# EAGLE design MiP_Proto-Back (EAGLE 6.5.0)
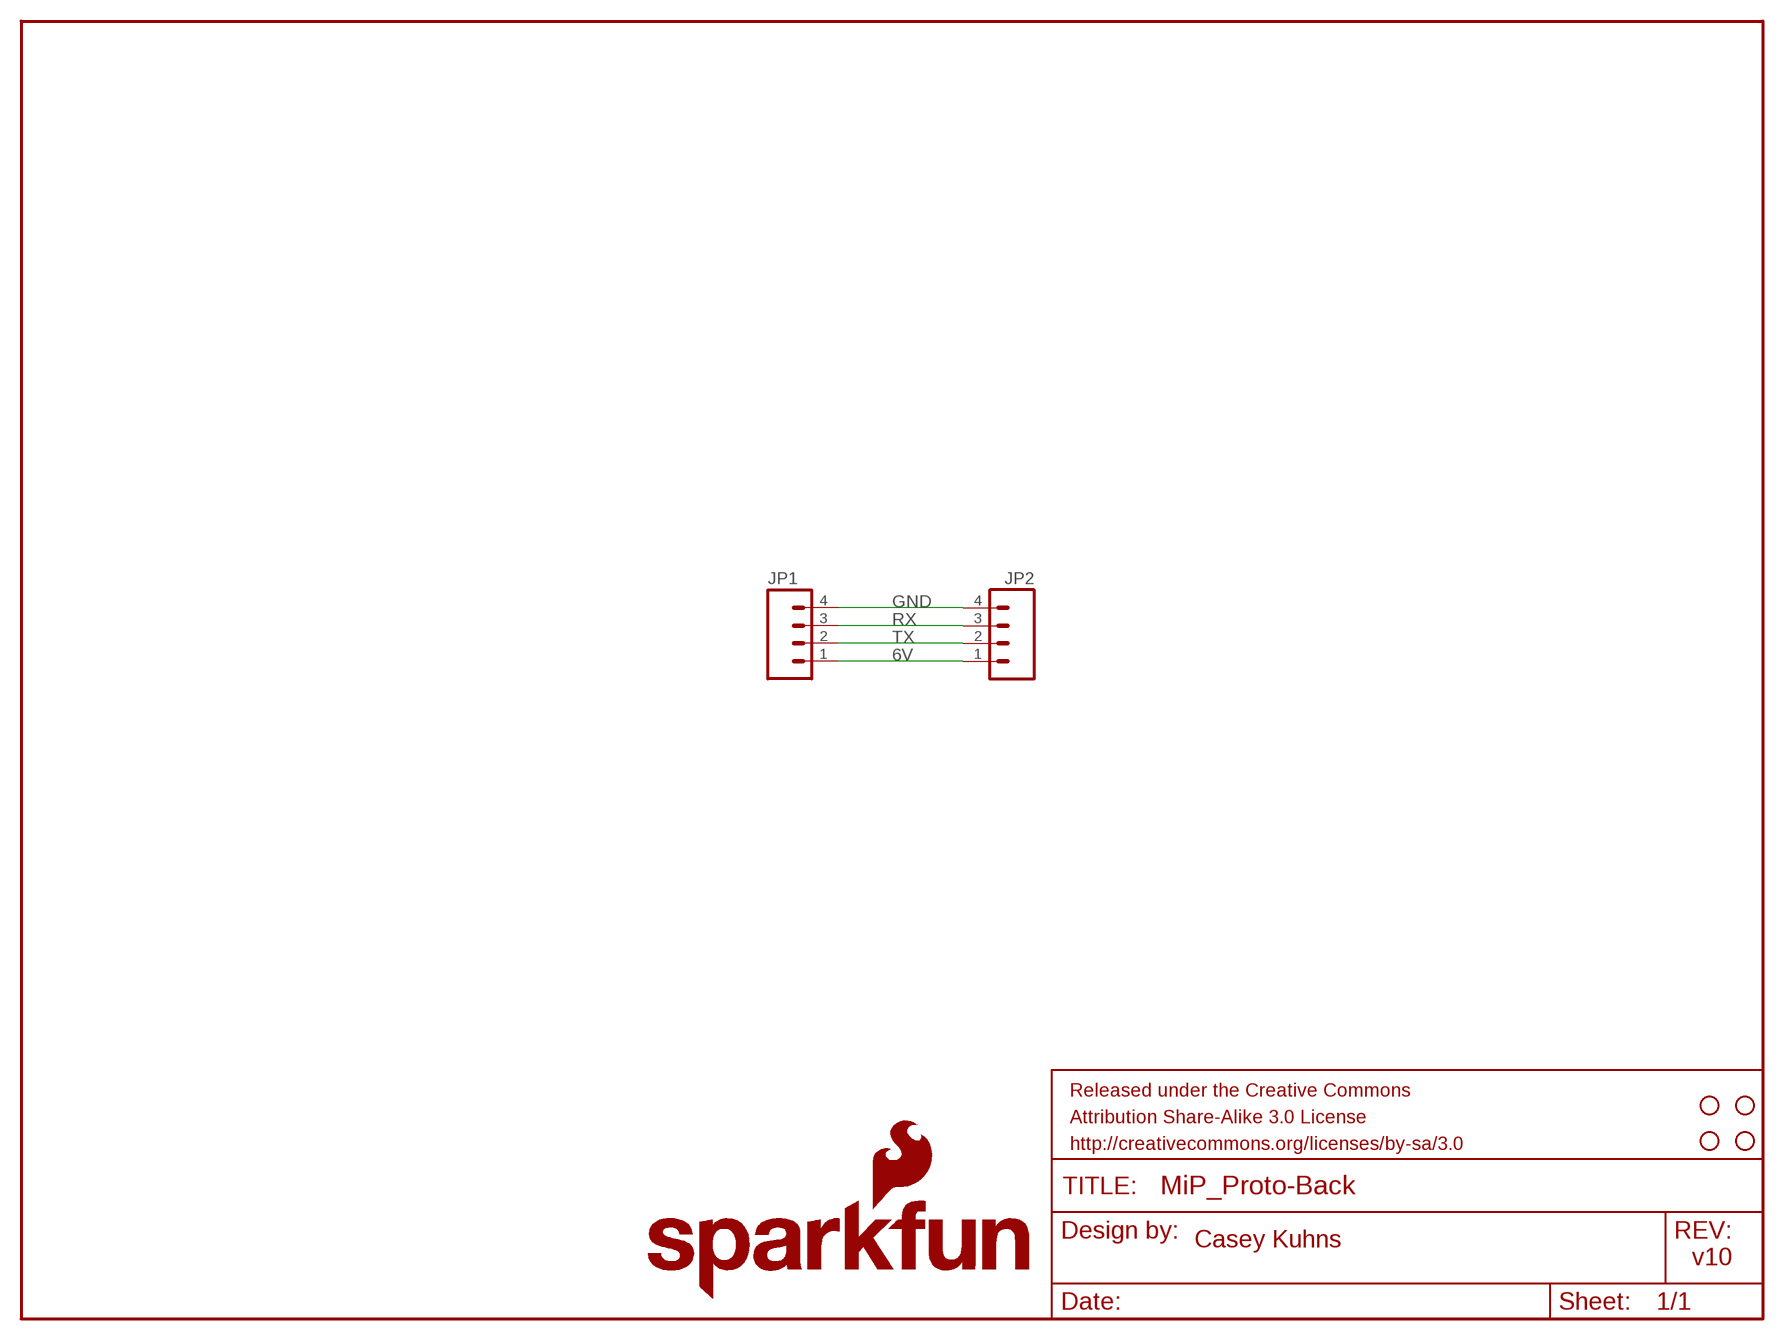
[diagram p0: schematic, sheet 1]

## Parts
FRAME1  FRAME-LETTER  [CREATIVE_COMMONS]
JP1  M04JST  [1X04-1.5MM_JST]
JP2  M04PTH  [1X04]
LOGO1  SFE_LOGO_NAME_FLAME.2_INCH  [SFE_LOGO_NAME_FLAME_.2]
STANDOFF1  STAND-OFF  [STAND-OFF]
STANDOFF2  STAND-OFF  [STAND-OFF]
STANDOFF3  STAND-OFF  [STAND-OFF]
STANDOFF4  STAND-OFF  [STAND-OFF]

## Nets
6V: JP1.1 JP2.1
GND: JP1.4 JP2.4
RX: JP1.3 JP2.3
TX: JP1.2 JP2.2

## Notes on the sheet
- Casey Kuhns
- v10

## Library data of the parts
FRAME1 = SparkFun-Aesthetics:FRAME-LETTER: Schematic Frame Standard 8.5x11 US Letter frame
JP1 JP2 = SparkFun-Connectors:M04: Header 4 Standard 4-pin 0.1" header. Use with straight break away headers (SKU : PRT-00116), right angle break away headers (PRT-00553), swiss pins (PRT-00743), machine pins (PRT-00117), and female headers (PRT-00115). Molex polarized connector foot print use with SKU : PRT-08231 with associated crimp pins and housings. 1MM SMD Version SKU: PRT-10208
LOGO1 = SparkFun-Aesthetics:SFE_LOGO_NAME_FLAME: SFE Logo, name and flame This is the SparkFun full logo. The logo on the schematic will always be the same size; the package variant is the height of the flame part of the logo. Default layer for the logo on the board is tSilk.
STANDOFF1-STANDOFF4 = SparkFun-Electromechanical:STAND-OFF: #4 Stand Off This is the mechanical footprint for a #4 phillips button head screw. Use the keepout ring to avoid running the screw head into surrounding components. SKU : PRT-00447

## Board
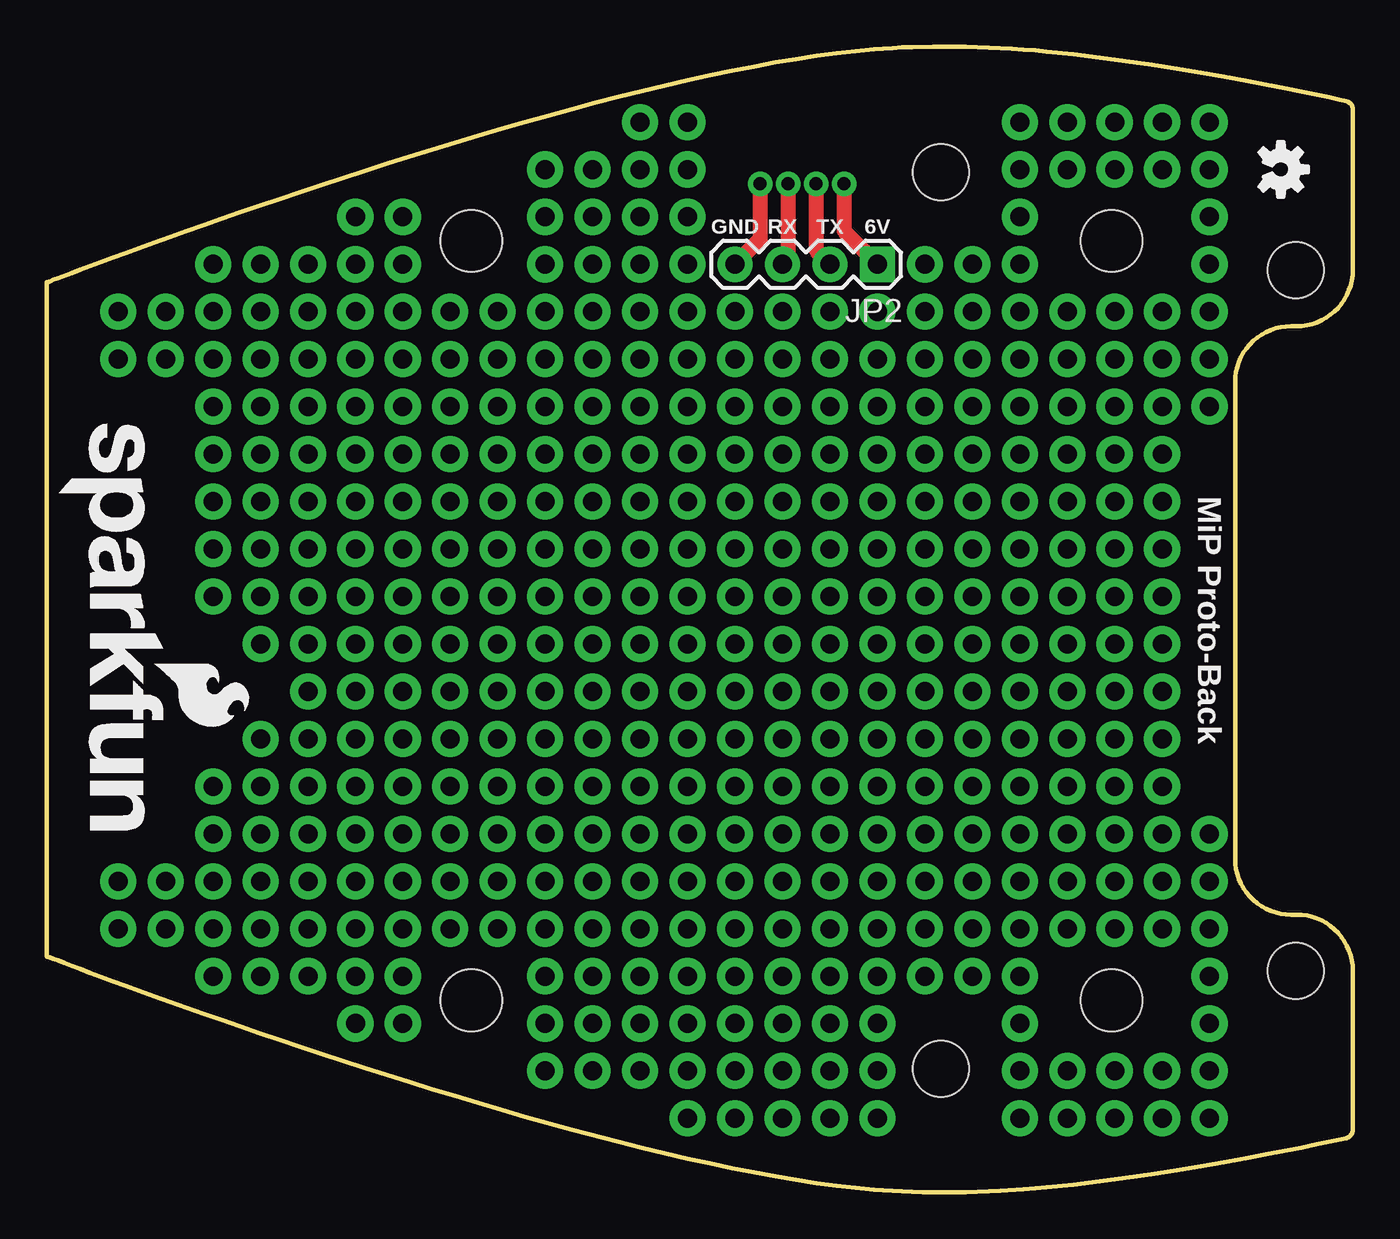
[diagram p1: board, top side]
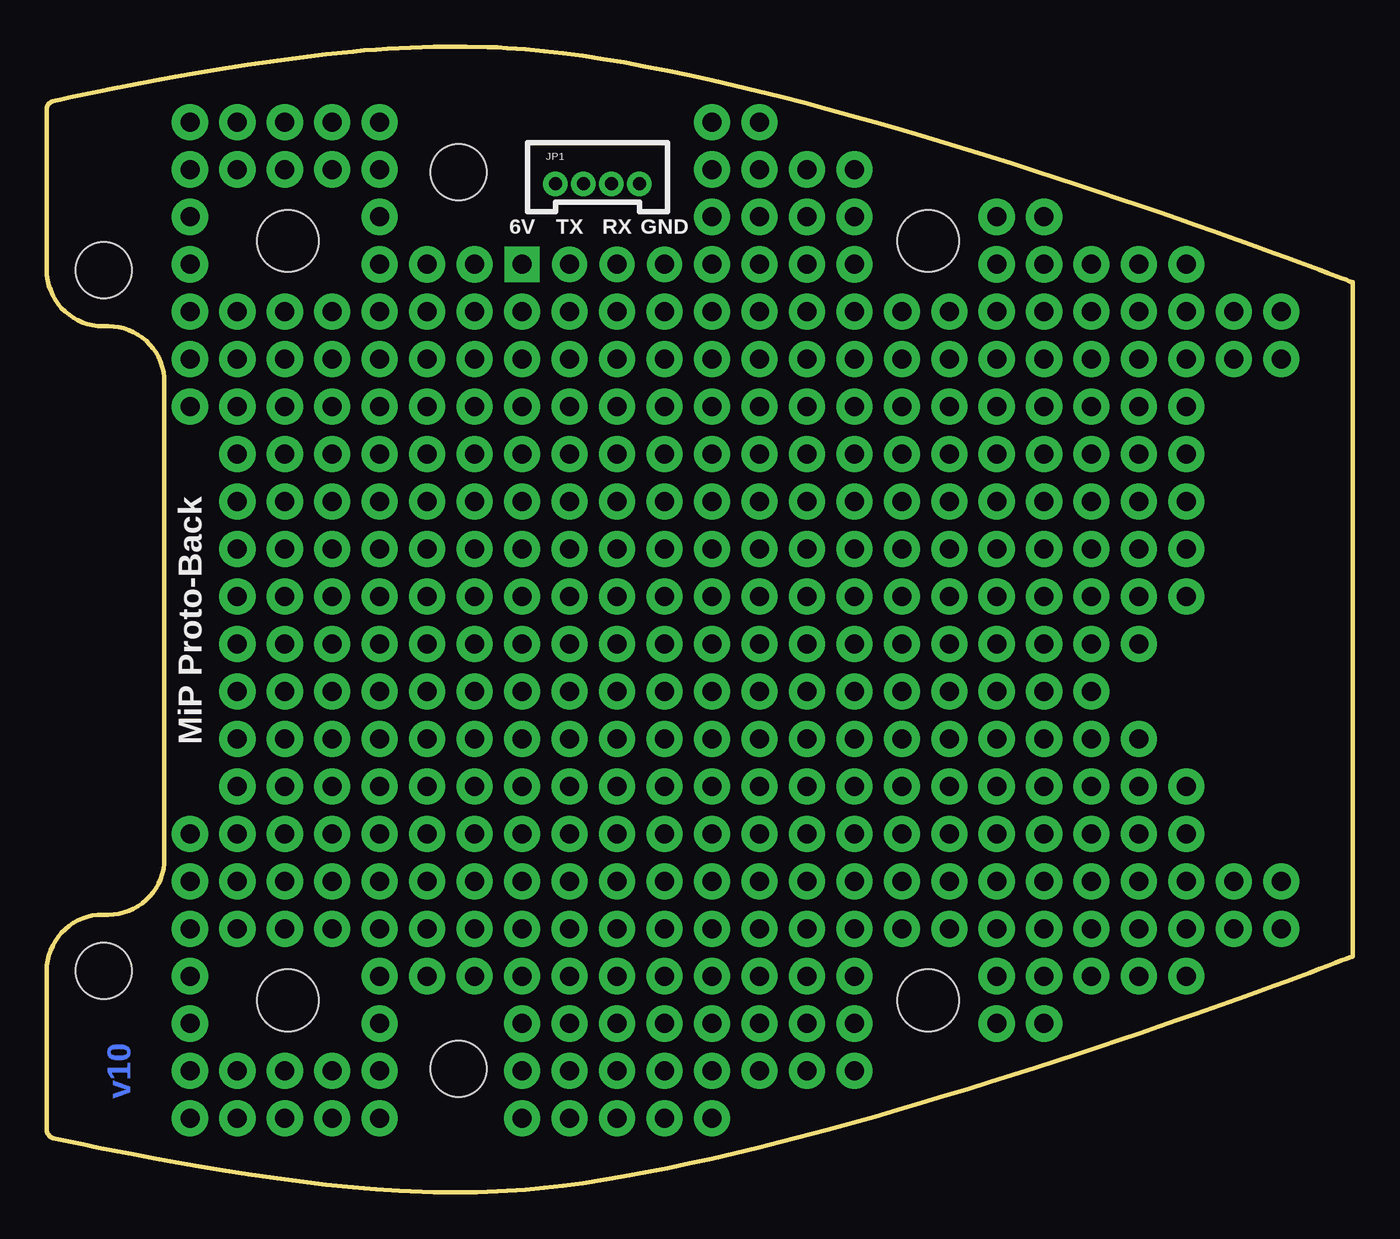
[diagram p2: board, bottom side, seen from below]

Size 69.91 x 61.32 mm. Coordinates in mm from the lower left corner, seen from the top.
Outline: 69.56,2.9 arc76 69.91,3.35 69.91,11.86 arc90 66.91,14.86 66.61,14.86 arc-90 63.61,17.86 63.61,43.36 arc-90 66.61,46.36 66.91,46.36 arc90 69.91,49.36 69.91,57.98 arc77 69.58,58.4 69.18,58.49 68.64,58.61 67.97,58.75 67.18,58.92 66.28,59.1 65.28,59.29 64.19,59.5 63.02,59.71 61.78,59.93 60.49,60.14 59.15,60.35 57.77,60.55 56.37,60.74 54.95,60.91 53.52,61.06 52.91,61.12 52.29,61.17 51.67,61.21 50.43,61.27 49.21,61.31 48.61,61.32 47.43,61.32 46.31,61.3 45.78,61.28 45.26,61.25 44.76,61.22 44.29,61.19 43.3,61.09 42.27,60.98 41.21,60.83 40.11,60.66 39,60.48 37.85,60.26 36.69,60.03 35.5,59.79 34.3,59.52 33.08,59.24 31.85,58.94 30.61,58.63 29.36,58.31 28.11,57.97 26.85,57.63 25.59,57.28 24.34,56.92 23.09,56.55 21.85,56.18 20.62,55.8 19.4,55.43 18.19,55.05 17,54.67 15.83,54.29 14.68,53.91 13.56,53.54 12.46,53.17 11.4,52.81 10.36,52.46 9.36,52.11 8.4,51.77 7.47,51.45 6.59,51.13 5.75,50.83 4.96,50.55 4.22,50.28 3.53,50.03 2.89,49.79 2.31,49.58 1.79,49.38 1.33,49.21 0.61,48.94 0.34,48.84 0.21,48.78 arc-10 0,48.71 0,12.67 arc63 0.04,12.61 0.16,12.57 0.35,12.49 0.61,12.4 0.94,12.27 1.33,12.12 1.79,11.95 2.31,11.75 2.89,11.54 3.53,11.3 4.22,11.05 4.96,10.78 5.75,10.5 6.59,10.2 7.48,9.88 8.4,9.56 9.36,9.22 10.36,8.87 11.4,8.52 12.46,8.16 13.56,7.79 14.68,7.42 15.83,7.04 17,6.66 18.19,6.28 19.4,5.9 20.62,5.52 21.85,5.15 23.09,4.78 24.34,4.41 25.59,4.05 28.11,3.35 30.61,2.69 31.85,2.38 33.08,2.09 34.3,1.8 35.5,1.54 36.69,1.29 37.85,1.06 39,0.85 40.11,0.66 41.21,0.49 42.27,0.35 43.3,0.23 44.29,0.14 44.76,0.1 45.26,0.07 45.78,0.05 46.31,0.03 46.87,0.01 47.43,0 48.61,0 49.21,0.01 50.43,0.05 51.05,0.08 52.29,0.16 52.91,0.21 53.52,0.26 54.95,0.41 56.37,0.59 57.77,0.77 59.14,0.97 60.48,1.18 61.78,1.39 63.01,1.6 64.18,1.81 65.26,2.02 66.26,2.21 67.16,2.39 67.95,2.56 68.62,2.7 69.16,2.82 69.56,2.9
Copper layers (1*16): Top 0.035mm / dielectric 1.5mm / Bottom 0.035mm
Design rules "default": minimum track width 7mil, minimum drill 15mil, track to track 8mil, track to pad 8mil, pad to pad 8mil, via to via 8mil, smd to smd 8mil, copper to edge 8mil, drill to drill 8mil, minimum pad ring 12mil, minimum via ring 10mil, stop-mask expansion 4mil, vias tented up to drill 20mil, thermal gap 10mil
Holes 3 mm at 47.86,6.61 47.86,54.61 66.86,49.36 66.86,11.86

### Footprints (pad centres in the part's own frame; a part is rotated, then mirrored left to right if it is on the bottom)
1X04-1.5MM_JST = drill 0.7: 1 0,0; 2 1.5,0; 3 3,0; 4 4.5,0
1X04 = drill 1.016 pad 1.88 square: 1 0,0 | drill 1.016 pad 1.88: 2 2.54,0; 3 5.08,0; 4 7.62,0
STAND-OFF = hole 3.302: 0,0

### Placement (x,y rotation side)
FRAME1  13.98,-8.75 0 top  (outside the outline)
JP1  42.68,53.99 0 bottom
JP2  44.46,49.67 180 top
LOGO1  0.55,41.86 270 top
LOGO2  OSHW-LOGOS  [OSHW-LOGO-S]  66.05,54.75 270 top
STANDOFF1  22.72,10.27 0 top
STANDOFF2  22.72,50.91 0 top
STANDOFF3  57.01,50.91 0 top
STANDOFF4  57.01,10.27 0 top

### Tracks (layer width: path | path; a pad name or v marks a point on that pad's centre or on a via)
6V
  Top 0.813: JP1.1 42.68,51.45 JP2.1
GND
  Top 0.813: JP1.4 38.18,51.01 JP2.4
N$1  (via drill 1.02 pad 1.93)
  other vias: 11.44,29.35
N$2  (via drill 1.02 pad 1.93)
  other vias: 13.98,29.35
N$3  (via drill 1.02 pad 1.93)
  other vias: 13.98,26.81
N$4  (via drill 1.02 pad 1.93)
  other vias: 13.98,24.27
N$5  (via drill 1.02 pad 1.93)
  other vias: 11.44,24.27
N$6  (via drill 1.02 pad 1.93)
  other vias: 13.98,21.73
N$7  (via drill 1.02 pad 1.93)
  other vias: 8.9,21.73
N$8  (via drill 1.02 pad 1.93)
  other vias: 16.52,29.35
N$9  (via drill 1.02 pad 1.93)
  other vias: 16.52,26.81
N$10  (via drill 1.02 pad 1.93)
  other vias: 16.52,24.27
N$11  (via drill 1.02 pad 1.93)
  other vias: 16.52,21.73
N$12  (via drill 1.02 pad 1.93)
  other vias: 19.06,29.35
N$13  (via drill 1.02 pad 1.93)
  other vias: 19.06,26.81
N$14  (via drill 1.02 pad 1.93)
  other vias: 19.06,24.27
N$15  (via drill 1.02 pad 1.93)
  other vias: 19.06,21.73
N$16  (via drill 1.02 pad 1.93)
  other vias: 21.6,29.35
N$17  (via drill 1.02 pad 1.93)
  other vias: 21.6,26.81
N$18  (via drill 1.02 pad 1.93)
  other vias: 21.6,24.27
N$19  (via drill 1.02 pad 1.93)
  other vias: 21.6,21.73
N$20  (via drill 1.02 pad 1.93)
  other vias: 24.14,29.35
N$21  (via drill 1.02 pad 1.93)
  other vias: 24.14,26.81
N$22  (via drill 1.02 pad 1.93)
  other vias: 24.14,24.27
N$23  (via drill 1.02 pad 1.93)
  other vias: 24.14,21.73
N$24  (via drill 1.02 pad 1.93)
  other vias: 26.68,29.35
N$25  (via drill 1.02 pad 1.93)
  other vias: 26.68,26.81
N$26  (via drill 1.02 pad 1.93)
  other vias: 26.68,24.27
N$27  (via drill 1.02 pad 1.93)
  other vias: 26.68,21.73
N$28  (via drill 1.02 pad 1.93)
  other vias: 29.22,29.35
N$29  (via drill 1.02 pad 1.93)
  other vias: 29.22,26.81
N$30  (via drill 1.02 pad 1.93)
  other vias: 29.22,24.27
N$31  (via drill 1.02 pad 1.93)
  other vias: 29.22,21.73
N$32  (via drill 1.02 pad 1.93)
  other vias: 31.76,29.35
N$33  (via drill 1.02 pad 1.93)
  other vias: 31.76,26.81
N$34  (via drill 1.02 pad 1.93)
  other vias: 31.76,24.27
N$35  (via drill 1.02 pad 1.93)
  other vias: 31.76,21.73
N$36  (via drill 1.02 pad 1.93)
  other vias: 34.3,29.35
N$37  (via drill 1.02 pad 1.93)
  other vias: 34.3,26.81
N$38  (via drill 1.02 pad 1.93)
  other vias: 34.3,24.27
N$39  (via drill 1.02 pad 1.93)
  other vias: 34.3,21.73
N$40  (via drill 1.02 pad 1.93)
  other vias: 36.84,29.35
N$41  (via drill 1.02 pad 1.93)
  other vias: 36.84,26.81
N$42  (via drill 1.02 pad 1.93)
  other vias: 36.84,24.27
N$43  (via drill 1.02 pad 1.93)
  other vias: 36.84,21.73
N$44  (via drill 1.02 pad 1.93)
  other vias: 39.38,29.35
N$45  (via drill 1.02 pad 1.93)
  other vias: 39.38,26.81
N$46  (via drill 1.02 pad 1.93)
  other vias: 39.38,24.27
N$47  (via drill 1.02 pad 1.93)
  other vias: 39.38,21.73
N$48  (via drill 1.02 pad 1.93)
  other vias: 41.92,29.35
N$49  (via drill 1.02 pad 1.93)
  other vias: 41.92,26.81
N$50  (via drill 1.02 pad 1.93)
  other vias: 41.92,24.27
N$51  (via drill 1.02 pad 1.93)
  other vias: 41.92,21.73
N$52  (via drill 1.02 pad 1.93)
  other vias: 44.46,29.35
N$53  (via drill 1.02 pad 1.93)
  other vias: 44.46,26.81
N$54  (via drill 1.02 pad 1.93)
  other vias: 44.46,24.27
N$55  (via drill 1.02 pad 1.93)
  other vias: 44.46,21.73
N$56  (via drill 1.02 pad 1.93)
  other vias: 47,29.35
N$57  (via drill 1.02 pad 1.93)
  other vias: 47,26.81
N$58  (via drill 1.02 pad 1.93)
  other vias: 47,24.27
N$59  (via drill 1.02 pad 1.93)
  other vias: 47,21.73
N$60  (via drill 1.02 pad 1.93)
  other vias: 49.54,29.35
N$61  (via drill 1.02 pad 1.93)
  other vias: 49.54,26.81
N$62  (via drill 1.02 pad 1.93)
  other vias: 49.54,24.27
N$63  (via drill 1.02 pad 1.93)
  other vias: 49.54,21.73
N$64  (via drill 1.02 pad 1.93)
  other vias: 52.08,29.35
N$65  (via drill 1.02 pad 1.93)
  other vias: 52.08,26.81
N$66  (via drill 1.02 pad 1.93)
  other vias: 52.08,24.27
N$67  (via drill 1.02 pad 1.93)
  other vias: 52.08,21.73
N$68  (via drill 1.02 pad 1.93)
  other vias: 13.98,19.19
N$69  (via drill 1.02 pad 1.93)
  other vias: 13.98,16.65
N$70  (via drill 1.02 pad 1.93)
  other vias: 13.98,14.11
N$71  (via drill 1.02 pad 1.93)
  other vias: 13.98,11.57
N$72  (via drill 1.02 pad 1.93)
  other vias: 16.52,19.19
N$73  (via drill 1.02 pad 1.93)
  other vias: 16.52,16.65
N$74  (via drill 1.02 pad 1.93)
  other vias: 16.52,14.11
N$75  (via drill 1.02 pad 1.93)
  other vias: 16.52,11.57
N$76  (via drill 1.02 pad 1.93)
  other vias: 19.06,19.19
N$77  (via drill 1.02 pad 1.93)
  other vias: 19.06,16.65
N$78  (via drill 1.02 pad 1.93)
  other vias: 19.06,14.11
N$79  (via drill 1.02 pad 1.93)
  other vias: 19.06,11.57
N$80  (via drill 1.02 pad 1.93)
  other vias: 21.6,19.19
N$81  (via drill 1.02 pad 1.93)
  other vias: 21.6,16.65
N$82  (via drill 1.02 pad 1.93)
  other vias: 21.6,14.11
N$83  (via drill 1.02 pad 1.93)
  other vias: 19.06,9.03
N$84  (via drill 1.02 pad 1.93)
  other vias: 24.14,19.19
N$85  (via drill 1.02 pad 1.93)
  other vias: 24.14,16.65
N$86  (via drill 1.02 pad 1.93)
  other vias: 24.14,14.11
N$88  (via drill 1.02 pad 1.93)
  other vias: 26.68,19.19
N$89  (via drill 1.02 pad 1.93)
  other vias: 26.68,16.65
N$90  (via drill 1.02 pad 1.93)
  other vias: 26.68,14.11
N$91  (via drill 1.02 pad 1.93)
  other vias: 26.68,11.57
N$92  (via drill 1.02 pad 1.93)
  other vias: 29.22,19.19
N$93  (via drill 1.02 pad 1.93)
  other vias: 29.22,16.65
N$94  (via drill 1.02 pad 1.93)
  other vias: 29.22,14.11
N$95  (via drill 1.02 pad 1.93)
  other vias: 29.22,11.57
N$96  (via drill 1.02 pad 1.93)
  other vias: 31.76,19.19
N$97  (via drill 1.02 pad 1.93)
  other vias: 31.76,16.65
N$98  (via drill 1.02 pad 1.93)
  other vias: 31.76,14.11
N$99  (via drill 1.02 pad 1.93)
  other vias: 31.76,11.57
N$117  (via drill 1.02 pad 1.93)
  other vias: 3.82,16.65
N$118  (via drill 1.02 pad 1.93)
  other vias: 3.82,14.11
N$121  (via drill 1.02 pad 1.93)
  other vias: 6.36,16.65
N$122  (via drill 1.02 pad 1.93)
  other vias: 6.36,14.11
N$124  (via drill 1.02 pad 1.93)
  other vias: 8.9,19.19
N$125  (via drill 1.02 pad 1.93)
  other vias: 8.9,16.65
N$126  (via drill 1.02 pad 1.93)
  other vias: 8.9,14.11
N$127  (via drill 1.02 pad 1.93)
  other vias: 8.9,11.57
N$128  (via drill 1.02 pad 1.93)
  other vias: 11.44,19.19
N$129  (via drill 1.02 pad 1.93)
  other vias: 11.44,16.65
N$130  (via drill 1.02 pad 1.93)
  other vias: 11.44,14.11
N$131  (via drill 1.02 pad 1.93)
  other vias: 11.44,11.57
N$132  (via drill 1.02 pad 1.93)
  other vias: 34.3,19.19
N$133  (via drill 1.02 pad 1.93)
  other vias: 34.3,16.65
N$134  (via drill 1.02 pad 1.93)
  other vias: 34.3,14.11
N$135  (via drill 1.02 pad 1.93)
  other vias: 34.3,11.57
N$136  (via drill 1.02 pad 1.93)
  other vias: 36.84,19.19
N$137  (via drill 1.02 pad 1.93)
  other vias: 36.84,16.65
N$138  (via drill 1.02 pad 1.93)
  other vias: 36.84,14.11
N$139  (via drill 1.02 pad 1.93)
  other vias: 36.84,11.57
N$140  (via drill 1.02 pad 1.93)
  other vias: 39.38,19.19
N$141  (via drill 1.02 pad 1.93)
  other vias: 39.38,16.65
N$142  (via drill 1.02 pad 1.93)
  other vias: 39.38,14.11
N$143  (via drill 1.02 pad 1.93)
  other vias: 39.38,11.57
N$144  (via drill 1.02 pad 1.93)
  other vias: 41.92,19.19
N$145  (via drill 1.02 pad 1.93)
  other vias: 41.92,16.65
N$146  (via drill 1.02 pad 1.93)
  other vias: 41.92,14.11
N$147  (via drill 1.02 pad 1.93)
  other vias: 41.92,11.57
N$148  (via drill 1.02 pad 1.93)
  other vias: 44.46,19.19
N$149  (via drill 1.02 pad 1.93)
  other vias: 44.46,16.65
N$150  (via drill 1.02 pad 1.93)
  other vias: 44.46,14.11
N$151  (via drill 1.02 pad 1.93)
  other vias: 44.46,11.57
N$152  (via drill 1.02 pad 1.93)
  other vias: 47,19.19
N$153  (via drill 1.02 pad 1.93)
  other vias: 47,16.65
N$154  (via drill 1.02 pad 1.93)
  other vias: 47,14.11
N$155  (via drill 1.02 pad 1.93)
  other vias: 47,11.57
N$156  (via drill 1.02 pad 1.93)
  other vias: 49.54,19.19
N$157  (via drill 1.02 pad 1.93)
  other vias: 49.54,16.65
N$158  (via drill 1.02 pad 1.93)
  other vias: 49.54,14.11
N$159  (via drill 1.02 pad 1.93)
  other vias: 49.54,11.57
N$160  (via drill 1.02 pad 1.93)
  other vias: 52.08,19.19
N$161  (via drill 1.02 pad 1.93)
  other vias: 52.08,16.65
N$162  (via drill 1.02 pad 1.93)
  other vias: 52.08,14.11
N$163  (via drill 1.02 pad 1.93)
  other vias: 52.08,11.57
N$167  (via drill 1.02 pad 1.93)
  other vias: 62.24,11.57
N$168  (via drill 1.02 pad 1.93)
  other vias: 54.62,14.11
N$169  (via drill 1.02 pad 1.93)
  other vias: 57.16,14.11
N$170  (via drill 1.02 pad 1.93)
  other vias: 59.7,14.11
N$171  (via drill 1.02 pad 1.93)
  other vias: 62.24,14.11
N$172  (via drill 1.02 pad 1.93)
  other vias: 54.62,16.65
N$173  (via drill 1.02 pad 1.93)
  other vias: 57.16,16.65
N$174  (via drill 1.02 pad 1.93)
  other vias: 59.7,16.65
N$175  (via drill 1.02 pad 1.93)
  other vias: 62.24,16.65
N$176  (via drill 1.02 pad 1.93)
  other vias: 54.62,19.19
N$177  (via drill 1.02 pad 1.93)
  other vias: 57.16,19.19
N$178  (via drill 1.02 pad 1.93)
  other vias: 59.7,19.19
N$179  (via drill 1.02 pad 1.93)
  other vias: 62.24,19.19
N$180  (via drill 1.02 pad 1.93)
  other vias: 54.62,21.73
N$181  (via drill 1.02 pad 1.93)
  other vias: 57.16,21.73
N$182  (via drill 1.02 pad 1.93)
  other vias: 59.7,21.73
N$184  (via drill 1.02 pad 1.93)
  other vias: 54.62,24.27
N$185  (via drill 1.02 pad 1.93)
  other vias: 57.16,24.27
N$186  (via drill 1.02 pad 1.93)
  other vias: 59.7,24.27
N$188  (via drill 1.02 pad 1.93)
  other vias: 54.62,26.81
N$189  (via drill 1.02 pad 1.93)
  other vias: 57.16,26.81
N$190  (via drill 1.02 pad 1.93)
  other vias: 59.7,26.81
N$192  (via drill 1.02 pad 1.93)
  other vias: 54.62,29.35
N$193  (via drill 1.02 pad 1.93)
  other vias: 57.16,29.35
N$194  (via drill 1.02 pad 1.93)
  other vias: 59.7,29.35
N$196  (via drill 1.02 pad 1.93)
  other vias: 44.46,39.51
N$197  (via drill 1.02 pad 1.93)
  other vias: 44.46,36.97
N$198  (via drill 1.02 pad 1.93)
  other vias: 44.46,34.43
N$199  (via drill 1.02 pad 1.93)
  other vias: 44.46,31.89
N$200  (via drill 1.02 pad 1.93)
  other vias: 47,39.51
N$201  (via drill 1.02 pad 1.93)
  other vias: 47,36.97
N$202  (via drill 1.02 pad 1.93)
  other vias: 47,34.43
N$203  (via drill 1.02 pad 1.93)
  other vias: 47,31.89
N$204  (via drill 1.02 pad 1.93)
  other vias: 49.54,39.51
N$205  (via drill 1.02 pad 1.93)
  other vias: 49.54,36.97
N$206  (via drill 1.02 pad 1.93)
  other vias: 49.54,34.43
N$207  (via drill 1.02 pad 1.93)
  other vias: 49.54,31.89
N$208  (via drill 1.02 pad 1.93)
  other vias: 52.08,39.51
N$209  (via drill 1.02 pad 1.93)
  other vias: 52.08,36.97
N$210  (via drill 1.02 pad 1.93)
  other vias: 52.08,34.43
N$211  (via drill 1.02 pad 1.93)
  other vias: 52.08,31.89
N$212  (via drill 1.02 pad 1.93)
  other vias: 54.62,39.51
N$213  (via drill 1.02 pad 1.93)
  other vias: 54.62,36.97
N$214  (via drill 1.02 pad 1.93)
  other vias: 54.62,34.43
N$215  (via drill 1.02 pad 1.93)
  other vias: 54.62,31.89
N$216  (via drill 1.02 pad 1.93)
  other vias: 57.16,39.51
N$217  (via drill 1.02 pad 1.93)
  other vias: 57.16,36.97
N$218  (via drill 1.02 pad 1.93)
  other vias: 57.16,34.43
N$219  (via drill 1.02 pad 1.93)
  other vias: 57.16,31.89
N$220  (via drill 1.02 pad 1.93)
  other vias: 59.7,39.51
N$221  (via drill 1.02 pad 1.93)
  other vias: 59.7,36.97
N$222  (via drill 1.02 pad 1.93)
  other vias: 59.7,34.43
N$223  (via drill 1.02 pad 1.93)
  other vias: 59.7,31.89
N$228  (via drill 1.02 pad 1.93)
  other vias: 24.14,39.51
N$229  (via drill 1.02 pad 1.93)
  other vias: 24.14,36.97
N$230  (via drill 1.02 pad 1.93)
  other vias: 24.14,34.43
N$231  (via drill 1.02 pad 1.93)
  other vias: 24.14,31.89
N$232  (via drill 1.02 pad 1.93)
  other vias: 26.68,39.51
N$233  (via drill 1.02 pad 1.93)
  other vias: 26.68,36.97
N$234  (via drill 1.02 pad 1.93)
  other vias: 26.68,34.43
N$235  (via drill 1.02 pad 1.93)
  other vias: 26.68,31.89
N$236  (via drill 1.02 pad 1.93)
  other vias: 29.22,39.51
N$237  (via drill 1.02 pad 1.93)
  other vias: 29.22,36.97
N$238  (via drill 1.02 pad 1.93)
  other vias: 29.22,34.43
N$239  (via drill 1.02 pad 1.93)
  other vias: 29.22,31.89
N$240  (via drill 1.02 pad 1.93)
  other vias: 31.76,39.51
N$241  (via drill 1.02 pad 1.93)
  other vias: 31.76,36.97
N$242  (via drill 1.02 pad 1.93)
  other vias: 31.76,34.43
N$243  (via drill 1.02 pad 1.93)
  other vias: 31.76,31.89
N$244  (via drill 1.02 pad 1.93)
  other vias: 34.3,39.51
N$245  (via drill 1.02 pad 1.93)
  other vias: 34.3,36.97
N$246  (via drill 1.02 pad 1.93)
  other vias: 34.3,34.43
N$247  (via drill 1.02 pad 1.93)
  other vias: 34.3,31.89
N$248  (via drill 1.02 pad 1.93)
  other vias: 36.84,39.51
N$249  (via drill 1.02 pad 1.93)
  other vias: 36.84,36.97
N$250  (via drill 1.02 pad 1.93)
  other vias: 36.84,34.43
N$251  (via drill 1.02 pad 1.93)
  other vias: 36.84,31.89
N$252  (via drill 1.02 pad 1.93)
  other vias: 39.38,39.51
N$253  (via drill 1.02 pad 1.93)
  other vias: 39.38,36.97
N$254  (via drill 1.02 pad 1.93)
  other vias: 39.38,34.43
N$255  (via drill 1.02 pad 1.93)
  other vias: 39.38,31.89
N$256  (via drill 1.02 pad 1.93)
  other vias: 41.92,39.51
N$257  (via drill 1.02 pad 1.93)
  other vias: 41.92,36.97
N$258  (via drill 1.02 pad 1.93)
  other vias: 41.92,34.43
N$259  (via drill 1.02 pad 1.93)
  other vias: 41.92,31.89
N$268  (via drill 1.02 pad 1.93)
  other vias: 8.9,39.51
N$269  (via drill 1.02 pad 1.93)
  other vias: 8.9,36.97
N$270  (via drill 1.02 pad 1.93)
  other vias: 8.9,34.43
N$271  (via drill 1.02 pad 1.93)
  other vias: 8.9,31.89
N$272  (via drill 1.02 pad 1.93)
  other vias: 11.44,39.51
N$273  (via drill 1.02 pad 1.93)
  other vias: 11.44,36.97
N$274  (via drill 1.02 pad 1.93)
  other vias: 11.44,34.43
N$275  (via drill 1.02 pad 1.93)
  other vias: 11.44,31.89
N$276  (via drill 1.02 pad 1.93)
  other vias: 13.98,39.51
N$277  (via drill 1.02 pad 1.93)
  other vias: 13.98,36.97
N$278  (via drill 1.02 pad 1.93)
  other vias: 13.98,34.43
N$279  (via drill 1.02 pad 1.93)
  other vias: 13.98,31.89
N$280  (via drill 1.02 pad 1.93)
  other vias: 16.52,39.51
N$281  (via drill 1.02 pad 1.93)
  other vias: 16.52,36.97
N$282  (via drill 1.02 pad 1.93)
  other vias: 16.52,34.43
N$283  (via drill 1.02 pad 1.93)
  other vias: 16.52,31.89
N$284  (via drill 1.02 pad 1.93)
  other vias: 19.06,39.51
N$285  (via drill 1.02 pad 1.93)
  other vias: 19.06,36.97
N$286  (via drill 1.02 pad 1.93)
  other vias: 19.06,34.43
N$287  (via drill 1.02 pad 1.93)
  other vias: 19.06,31.89
N$288  (via drill 1.02 pad 1.93)
  other vias: 21.6,39.51
N$289  (via drill 1.02 pad 1.93)
  other vias: 21.6,36.97
N$290  (via drill 1.02 pad 1.93)
  other vias: 21.6,34.43
N$291  (via drill 1.02 pad 1.93)
  other vias: 21.6,31.89
N$292  (via drill 1.02 pad 1.93)
  other vias: 16.52,52.21
N$293  (via drill 1.02 pad 1.93)
  other vias: 3.82,47.13
N$294  (via drill 1.02 pad 1.93)
  other vias: 3.82,44.59
N$296  (via drill 1.02 pad 1.93)
  other vias: 19.06,52.21
N$297  (via drill 1.02 pad 1.93)
  other vias: 6.36,47.13
N$298  (via drill 1.02 pad 1.93)
  other vias: 6.36,44.59
N$300  (via drill 1.02 pad 1.93)
  other vias: 8.9,49.67
N$301  (via drill 1.02 pad 1.93)
  other vias: 8.9,47.13
N$302  (via drill 1.02 pad 1.93)
  other vias: 8.9,44.59
N$303  (via drill 1.02 pad 1.93)
  other vias: 8.9,42.05
N$304  (via drill 1.02 pad 1.93)
  other vias: 11.44,49.67
N$305  (via drill 1.02 pad 1.93)
  other vias: 11.44,47.13
N$306  (via drill 1.02 pad 1.93)
  other vias: 11.44,44.59
N$307  (via drill 1.02 pad 1.93)
  other vias: 11.44,42.05
N$308  (via drill 1.02 pad 1.93)
  other vias: 13.98,49.67
N$309  (via drill 1.02 pad 1.93)
  other vias: 13.98,47.13
N$310  (via drill 1.02 pad 1.93)
  other vias: 13.98,44.59
N$311  (via drill 1.02 pad 1.93)
  other vias: 13.98,42.05
N$312  (via drill 1.02 pad 1.93)
  other vias: 16.52,49.67
N$313  (via drill 1.02 pad 1.93)
  other vias: 16.52,47.13
N$314  (via drill 1.02 pad 1.93)
  other vias: 16.52,44.59
N$315  (via drill 1.02 pad 1.93)
  other vias: 16.52,42.05
N$316  (via drill 1.02 pad 1.93)
  other vias: 19.06,49.67
N$317  (via drill 1.02 pad 1.93)
  other vias: 19.06,47.13
N$318  (via drill 1.02 pad 1.93)
  other vias: 19.06,44.59
N$319  (via drill 1.02 pad 1.93)
  other vias: 19.06,42.05
N$321  (via drill 1.02 pad 1.93)
  other vias: 21.6,47.13
N$322  (via drill 1.02 pad 1.93)
  other vias: 21.6,44.59
N$323  (via drill 1.02 pad 1.93)
  other vias: 21.6,42.05
N$325  (via drill 1.02 pad 1.93)
  other vias: 24.14,47.13
N$326  (via drill 1.02 pad 1.93)
  other vias: 24.14,44.59
N$327  (via drill 1.02 pad 1.93)
  other vias: 24.14,42.05
N$328  (via drill 1.02 pad 1.93)
  other vias: 26.68,49.67
N$329  (via drill 1.02 pad 1.93)
  other vias: 26.68,47.13
N$330  (via drill 1.02 pad 1.93)
  other vias: 26.68,44.59
N$331  (via drill 1.02 pad 1.93)
  other vias: 26.68,42.05
N$332  (via drill 1.02 pad 1.93)
  other vias: 29.22,49.67
N$333  (via drill 1.02 pad 1.93)
  other vias: 29.22,47.13
N$334  (via drill 1.02 pad 1.93)
  other vias: 29.22,44.59
N$335  (via drill 1.02 pad 1.93)
  other vias: 29.22,42.05
N$336  (via drill 1.02 pad 1.93)
  other vias: 31.76,49.67
N$337  (via drill 1.02 pad 1.93)
  other vias: 31.76,47.13
N$338  (via drill 1.02 pad 1.93)
  other vias: 31.76,44.59
N$339  (via drill 1.02 pad 1.93)
  other vias: 31.76,42.05
N$340  (via drill 1.02 pad 1.93)
  other vias: 34.3,49.67
N$341  (via drill 1.02 pad 1.93)
  other vias: 34.3,47.13
N$342  (via drill 1.02 pad 1.93)
  other vias: 34.3,44.59
N$343  (via drill 1.02 pad 1.93)
  other vias: 34.3,42.05
N$345  (via drill 1.02 pad 1.93)
  other vias: 36.84,47.13
N$346  (via drill 1.02 pad 1.93)
  other vias: 36.84,44.59
N$347  (via drill 1.02 pad 1.93)
  other vias: 36.84,42.05
N$349  (via drill 1.02 pad 1.93)
  other vias: 39.38,47.13
N$350  (via drill 1.02 pad 1.93)
  other vias: 39.38,44.59
N$351  (via drill 1.02 pad 1.93)
  other vias: 39.38,42.05
N$353  (via drill 1.02 pad 1.93)
  other vias: 41.92,47.13
N$354  (via drill 1.02 pad 1.93)
  other vias: 41.92,44.59
N$355  (via drill 1.02 pad 1.93)
  other vias: 41.92,42.05
N$357  (via drill 1.02 pad 1.93)
  other vias: 44.46,47.13
N$358  (via drill 1.02 pad 1.93)
  other vias: 44.46,44.59
N$359  (via drill 1.02 pad 1.93)
  other vias: 44.46,42.05
N$360  (via drill 1.02 pad 1.93)
  other vias: 47,49.67
N$361  (via drill 1.02 pad 1.93)
  other vias: 47,47.13
N$362  (via drill 1.02 pad 1.93)
  other vias: 47,44.59
N$363  (via drill 1.02 pad 1.93)
  other vias: 47,42.05
N$364  (via drill 1.02 pad 1.93)
  other vias: 49.54,49.67
N$365  (via drill 1.02 pad 1.93)
  other vias: 49.54,47.13
N$366  (via drill 1.02 pad 1.93)
  other vias: 49.54,44.59
N$367  (via drill 1.02 pad 1.93)
  other vias: 49.54,42.05
N$368  (via drill 1.02 pad 1.93)
  other vias: 52.08,49.67
N$369  (via drill 1.02 pad 1.93)
  other vias: 52.08,47.13
N$370  (via drill 1.02 pad 1.93)
  other vias: 52.08,44.59
N$371  (via drill 1.02 pad 1.93)
  other vias: 52.08,42.05
N$373  (via drill 1.02 pad 1.93)
  other vias: 54.62,47.13
N$374  (via drill 1.02 pad 1.93)
  other vias: 54.62,44.59
N$375  (via drill 1.02 pad 1.93)
  other vias: 54.62,42.05
N$376  (via drill 1.02 pad 1.93)
  other vias: 62.24,9.03
N$377  (via drill 1.02 pad 1.93)
  other vias: 57.16,47.13
N$378  (via drill 1.02 pad 1.93)
  other vias: 57.16,44.59
N$379  (via drill 1.02 pad 1.93)
  other vias: 57.16,42.05
N$381  (via drill 1.02 pad 1.93)
  other vias: 59.7,47.13
N$382  (via drill 1.02 pad 1.93)
  other vias: 59.7,44.59
N$383  (via drill 1.02 pad 1.93)
  other vias: 59.7,42.05
N$384  (via drill 1.02 pad 1.93)
  other vias: 62.24,49.67
N$385  (via drill 1.02 pad 1.93)
  other vias: 62.24,47.13
N$386  (via drill 1.02 pad 1.93)
  other vias: 62.24,44.59
N$387  (via drill 1.02 pad 1.93)
  other vias: 62.24,42.05
N$391  (via drill 1.02 pad 1.93)
  other vias: 26.68,52.21
N$394  (via drill 1.02 pad 1.93)
  other vias: 29.22,54.75
N$395  (via drill 1.02 pad 1.93)
  other vias: 29.22,52.21
N$397  (via drill 1.02 pad 1.93)
  other vias: 31.76,57.29
N$398  (via drill 1.02 pad 1.93)
  other vias: 31.76,54.75
N$399  (via drill 1.02 pad 1.93)
  other vias: 31.76,52.21
N$401  (via drill 1.02 pad 1.93)
  other vias: 34.3,57.29
N$402  (via drill 1.02 pad 1.93)
  other vias: 34.3,54.75
N$403  (via drill 1.02 pad 1.93)
  other vias: 34.3,52.21
N$421  (via drill 1.02 pad 1.93)
  other vias: 16.52,9.03
N$424  (via drill 1.02 pad 1.93)
  other vias: 26.68,9.03
N$425  (via drill 1.02 pad 1.93)
  other vias: 26.68,6.49
N$428  (via drill 1.02 pad 1.93)
  other vias: 29.22,9.03
N$429  (via drill 1.02 pad 1.93)
  other vias: 29.22,6.49
N$432  (via drill 1.02 pad 1.93)
  other vias: 31.76,9.03
N$433  (via drill 1.02 pad 1.93)
  other vias: 31.76,6.49
N$436  (via drill 1.02 pad 1.93)
  other vias: 34.3,9.03
N$437  (via drill 1.02 pad 1.93)
  other vias: 34.3,6.49
N$438  (via drill 1.02 pad 1.93)
  other vias: 34.3,3.95
N$440  (via drill 1.02 pad 1.93)
  other vias: 36.84,9.03
N$441  (via drill 1.02 pad 1.93)
  other vias: 36.84,6.49
N$442  (via drill 1.02 pad 1.93)
  other vias: 36.84,3.95
N$444  (via drill 1.02 pad 1.93)
  other vias: 39.38,9.03
N$445  (via drill 1.02 pad 1.93)
  other vias: 39.38,6.49
N$446  (via drill 1.02 pad 1.93)
  other vias: 39.38,3.95
N$448  (via drill 1.02 pad 1.93)
  other vias: 41.92,9.03
N$449  (via drill 1.02 pad 1.93)
  other vias: 41.92,6.49
N$450  (via drill 1.02 pad 1.93)
  other vias: 41.92,3.95
N$452  (via drill 1.02 pad 1.93)
  other vias: 44.46,9.03
N$453  (via drill 1.02 pad 1.93)
  other vias: 44.46,6.49
N$454  (via drill 1.02 pad 1.93)
  other vias: 44.46,3.95
N$464  (via drill 1.02 pad 1.93)
  other vias: 52.08,9.03
N$465  (via drill 1.02 pad 1.93)
  other vias: 52.08,6.49
N$466  (via drill 1.02 pad 1.93)
  other vias: 52.08,3.95
N$469  (via drill 1.02 pad 1.93)
  other vias: 54.62,6.49
N$470  (via drill 1.02 pad 1.93)
  other vias: 54.62,3.95
N$473  (via drill 1.02 pad 1.93)
  other vias: 57.16,6.49
N$474  (via drill 1.02 pad 1.93)
  other vias: 57.16,3.95
N$477  (via drill 1.02 pad 1.93)
  other vias: 59.7,6.49
N$478  (via drill 1.02 pad 1.93)
  other vias: 59.7,3.95
N$481  (via drill 1.02 pad 1.93)
  other vias: 62.24,6.49
N$482  (via drill 1.02 pad 1.93)
  other vias: 62.24,3.95
N$493  (via drill 1.02 pad 1.93)
  other vias: 52.08,57.29
N$494  (via drill 1.02 pad 1.93)
  other vias: 52.08,54.75
N$495  (via drill 1.02 pad 1.93)
  other vias: 52.08,52.21
N$497  (via drill 1.02 pad 1.93)
  other vias: 54.62,57.29
N$498  (via drill 1.02 pad 1.93)
  other vias: 54.62,54.75
N$501  (via drill 1.02 pad 1.93)
  other vias: 57.16,57.29
N$502  (via drill 1.02 pad 1.93)
  other vias: 57.16,54.75
N$505  (via drill 1.02 pad 1.93)
  other vias: 59.7,57.29
N$506  (via drill 1.02 pad 1.93)
  other vias: 59.7,54.75
N$509  (via drill 1.02 pad 1.93)
  other vias: 62.24,57.29
N$510  (via drill 1.02 pad 1.93)
  other vias: 62.24,54.75
N$511  (via drill 1.02 pad 1.93)
  other vias: 62.24,52.21
N$516  (via drill 1.02 pad 1.93)
  other vias: 26.68,54.75
N$B  (via drill 1.02 pad 1.93)
  other vias: 11.44,21.73
RX
  Top 0.813: JP1.3 39.68,49.97 JP2.3
TX
  Top 0.813: JP1.2 41.18,50.41 JP2.2

### Text on the board
Bottom: v10
tPlace: GND | RX | TX | 6V | MiP Proto-Back
bPlace: GND | RX | TX | 6V | MiP Proto-Back
tDocu: Casey Kuhns